# Altium schematic sheet IMU.SchDoc: Flyer-IMU
size A4; Revision: 1.0
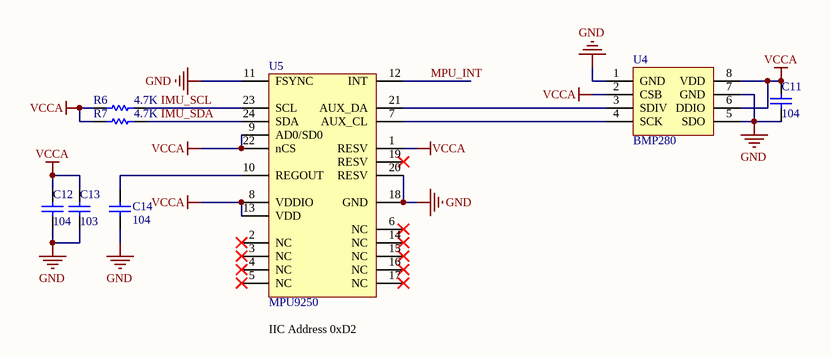
[diagram p0: IMU.SchDoc]

## Parts
C11  104  [C0603]
C12  104  [C0603]
C13  103  [C0603]
C14  104  [C0603]
R6  4.7K  [R0603]
R7  4.7K  [R0603]
U4  BMP280  [LGA-8]
U5  MPU9250  [QFN-24-0.4]

## Nets
GND: C11.1 C12.1 C13.1 C14.1 U4.1(GND) U4.5(SDO) U4.7(GND) U5.11(FSYNC) U5.18(GND) U5.20(RESV)
VCCA: C11.2 C12.2 C13.2 R6.1 R7.1 U4.2(CSB) U4.6(DDIO) U4.8(VDD) U5.1(RESV) U5.8(VDDIO) U5.9(AD0/SD0) U5.13(VDD) U5.22(nCS)
IMU_SCL: R6.2 U5.23(SCL)
IMU_SDA: R7.2 U5.24(SDA)
MPU_INT: U5.12(INT)
NetC14_2: C14.2 U5.10(REGOUT)
NetU4_3: U4.3(SDIV) U5.21(AUX_DA)
NetU4_4: U4.4(SCK) U5.7(AUX_CL)

Not connected (* = marked no-connect by the designer): U5 2(NC)* 3(NC)* 4(NC)* 5(NC)* 6(NC)* 14(NC)* 15(NC)* 16(NC)* 17(NC)* 19(RESV)*

## Notes on the sheet
- (near U5) IIC Address 0xD2
- Title
- Size:
- Date:
- A4
- Number:
- Time:
- Revision:
- Sheet
- of
- File:

## Library data of the parts
C11-C14 = C0603: 电容; Published: 8-Jun-2000; LatestRevisionDate: 17-Jul-2002; LatestRevisionNote: Re-released for DXP Platform.; PackageReference: RAD-0.3; Publisher: Altium Limited; PackageDescription: Radial Cap, Thru-Hole; 2 Leads; 0.3 in Pin Spacing; UnitPrice: 0.02
R6 R7 = RES0603: 电阻; Published: 8-Jun-2000; LatestRevisionDate: 17-Jul-2002; LatestRevisionNote: Re-released for DXP Platform.; PackageReference: AXIAL-0.3; Publisher: Altium Limited; PackageDescription: Axial Device, Thru-Hole; 2 Leads; 0.3 in Pin Spacing
U4 = BMP280: 气压剂
U5 = MPU9250: 9轴运动处理传感器